# Altium schematic sheet SOC_module.SchDoc
size A4
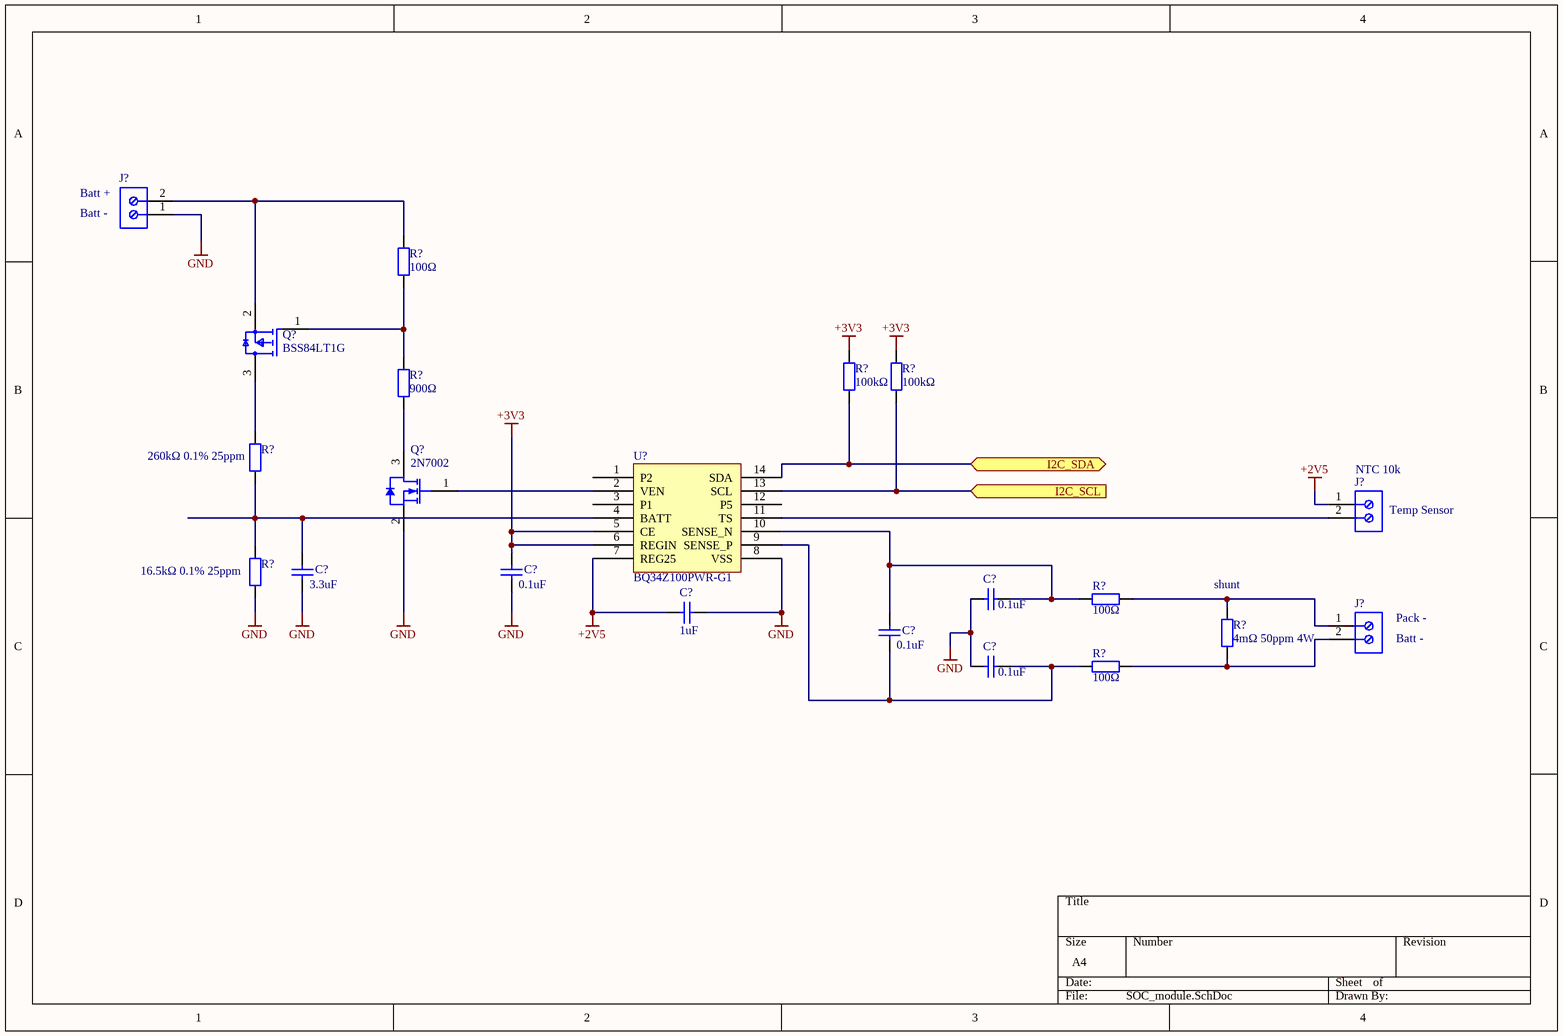
[diagram p0: SOC_module.SchDoc]

## Parts
(Parts that share a designator on the sheet are numbered #1, #2 ... from top to bottom, then left to right.)
C?#1  3.3uF  [CAPC2013X88X50ML20T25]
C?#2  0.1uF  [CAPC2013X88X50ML20T25]
C?#3  0.1uF  [CAPC2013X88X50ML20T25]
C?#4  1uF  [CAPC2013X88X50ML20T25]
C?#5  0.1uF  [CAPC2013X88X50ML20T25]
C?#6  0.1uF  [CAPC2013X88X50ML20T25]
J?#1  1725656  [PHOE-1725656-2]  (value not drawn)
J?#2  1725656  [PHOE-1725656-2]  (value not drawn)
J?#3  1725656  [PHOE-1725656-2]  (value not drawn)
Q?#1  BSS84LT1G  [FP-318-08-IPC_A]
Q?#2  2N7002  [STM-SOT-23-3_V]
R?#1  100Ω  [RESC2013X50X30ML20T20]
R?#2  100kΩ  [RESC2013X50X30ML20T20]
R?#3  100kΩ  [RESC2013X50X30ML20T20]
R?#4  900Ω  [RESC2013X50X30ML20T20]
R?#5  260kΩ 0.1% 25ppm  [RESC2013X50X30ML20T20]
R?#6  16.5kΩ 0.1% 25ppm  [RESC2013X50X30ML20T20]
R?#7  100Ω  [RESC2013X50X30ML20T20]
R?#8  4mΩ 50ppm 4W  [RESC2013X50X30ML20T20]
R?#9  100Ω  [RESC2013X50X30ML20T20]
U?  BQ34Z100PWR-G1

## Ports
I2C_SCL (in), I2C_SDA (bidir)

## Nets
+2V5: C?#4.2 J?#2.1 U?.7(REG25)
+3V3: C?#2.2 R?#2.2 R?#3.2 U?.5(CE) U?.6(REGIN)
GND: C?#1.1 C?#2.1 C?#3.1 C?#4.1 C?#6.1 J?#1.1 Q?#2.2(S) R?#6.2 U?.8(VSS)
I2C_SCL: R?#3.1 U?.13(SCL) ; port I2C_SCL
I2C_SDA: R?#2.1 U?.14(SDA) ; port I2C_SDA
NetC?#1_2: C?#1.2 R?#5.2 R?#6.1 U?.4(BATT)
NetC?#3_2: C?#3.2 C?#5.2 R?#7.1 U?.10(SENSE_N)
NetC?#5_1: C?#5.1 C?#6.2 R?#9.1 U?.9(SENSE_P)
NetJ?#1_2: J?#1.2 Q?#1.2(S) R?#1.2
NetJ?#2_2: J?#2.2 U?.11(TS)
NetJ?#3_1: J?#3.1 R?#7.2 R?#8.2
NetJ?#3_2: J?#3.2 R?#8.1 R?#9.2
NetQ?#1_1: Q?#1.1(G) R?#1.1 R?#4.2
NetQ?#1_3: Q?#1.3(D) R?#5.1
NetQ?#2_1: Q?#2.1(G) U?.2(VEN)
NetQ?#2_3: Q?#2.3(D) R?#4.1

Not connected (* = marked no-connect by the designer): U? 1(P2) 3(P1) 12(P5)

## Notes on the sheet
- (near J?#1) Batt +
- (near J?#1) Batt -
- (near J?#2) NTC 10k
- (near J?#2) Temp Sensor
- (near R?#8) shunt
- (near J?#3) Pack -
- (near J?#3) Batt -

## Library data of the parts
C?#1-C?#6 = Cap_0805: Capacitor
J?#1-J?#3 = CMP-2000-05299-1: Male Header, Pitch 2.54 mm, 1 x 2 Position, Height 9 mm, Tail Length 3.5 mm; Manufacturer: Phoenix Contact; Number of contacts: 2; Content: 250pc(s); Pitch: 2.54mm; Industrial packaging: Yes; Colour: Green; Manufacturer part No.: 1725656; Type: MPT0,5/2-2,54; Datasheet URL: http://datasheet.octopart.com/1725656-Phoenix-Contact-datasheet-5302866.pdf; Manufacturer URL: http://www.phoenixcontact.com/; Datasheet Version: Apr-08
Q?#1 = CMP-1058-00762-2: MOSFET P-CH 50V 130MA SOT-23; Max Power Dissipation: 225mW; On-State Resistance: 10R; Nominal Vgs: 2V; Gate to Source Voltage (Vgs): 20V; Rise Time: 1ns; Turn-Off Delay Time: 16ns; Voltage Rating (DC): -50V; Turn-On Delay Time: 3.6ns; Number of Elements: 1; Current Rating: -130mA; Input Capacitance: 30pF; Threshold Voltage: -2V; Element Configuration: Single; Drain to Source Breakdown Voltage: 50V; Continuous Drain Current (ID): 130mA; Length: 0.119inch; Drain to Source Voltage (Vdss): 50V; Min Operating Temperature: -55°C; Contact Plating: Tin; Lead Free: Lead Free; Width: 0.055inch; Case/Package: SOT-23-3; Max Operating Temperature: 150°C; Halogen Free: Halogen Free; Radiation Hardening: No; Drain to Source Resistance: 10R; REACH SVHC: No SVHC; Power Dissipation: 225mW; Number of Pins: 3; Package Quantity: 1; Packaging: Tape and Reel; Fall Time: 1ns; Rds On Max: 10R; Height: 0.04inch
Q?#2 = CMP-0434-00001-1: N-channel 60 V, 1.8 Ohm, 0.35 A STripFET(TM) II Power MOSFET, SOT23; Manufacturer: STMicroelectronics; PartNumber: 2N7002; ComponentLink2Description: Datasheet; ComponentLink2URL: http://www.st.com/st-web-ui/static/active/en/resource/technical/document/datasheet/CD00005134.pdf; ComponentLink1Description: Manufacturer URL; ComponentLink1URL: http://www.st.com/; DatasheetVersion: Rev. 9, 11/2008; PackageReference: SOT-23; Mounting Technology: Surface Mount; PackageDescription: 3-Pin SOT23, 3.016 x 2.8 mm Body, 0.95 mm Pitch
R?#1-R?#9 = Res_0805: Resistor
U? = BQ34Z100PWR-G1: Multi-chemistry Impedance Track™ standalone fuel gauge | battery gas gauge 14-TSSOP -40 to 85; Manufacturer: Texas Instruments; Interface: I2C; Operating Supply Voltage: 4.5V; Supplier 1: Digi-Key; Manufacturer Part Number: BQ34Z100PWR-G1; RoHS: Yes; Category: Battery Management; Pricing 1: 1=4.81000, 10=4.31700, 25=4.08080, 100=3.53660, 250=3.35528, 500=3.01068, 1000=2.99425 (USD); Mount: Surface Mount; Case/Package: TSSOP; Number of Pins: 14; Weight: 0.004949oz; Contact Plating: Gold; Min Operating Temperature: -40°C; Max Operating Temperature: 85°C; Packaging: Tape and Reel; Package Quantity: 2000; Lead Free: Lead Free; RoHS Compliant: Yes; ComponentLink1URL: http://www.ti.com/lit/ds/symlink/bq34z100-g1.pdf?src-supplier=Digi-Key; ComponentLink1Description: http://www.ti.com/lit/ds/symlink/bq34z100-g1.pdf?src-supplier=Digi-Key; ComponentLink2URL: http://www.ti.com/general/docs/lit/getliterature.tsp?genericPartNumber=BQ34Z100-G1&&fileType=pdf&src-supplier=Avnet; ComponentLink2Description: http://www.ti.com/general/docs/lit/getliterature.tsp?genericPartNumber=BQ34Z100-G1&&fileType=pdf&src-supplier=Avnet; ComponentLink3URL: http://www.ti.com/lit/gpn/bq34z100-g1?src-supplier=Mouser; ComponentLink3Description: http://www.ti.com/lit/gpn/bq34z100-g1?src-supplier=Mouser; Supplier Part Number 1: 296-39949-6-ND